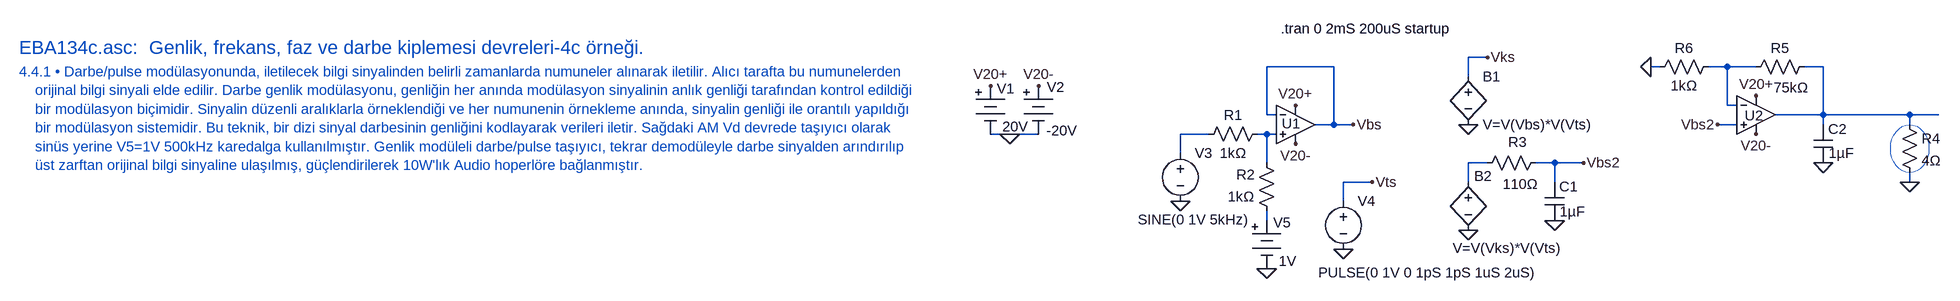
[diagram p0: schematic EBA134c.asc]
EBA134c.asc, the LTspice schematic file:
Version 4
SHEET 1 5332 4332
WIRE 2512 64 2480 64
WIRE 2256 80 2144 80
WIRE 2800 80 2784 80
WIRE 2912 80 2880 80
WIRE 2960 80 2912 80
WIRE 3072 80 3040 80
WIRE 2480 96 2480 64
WIRE 2912 144 2912 80
WIRE 2928 144 2912 144
WIRE 2144 160 2144 80
WIRE 2160 160 2144 160
WIRE 3072 160 3072 80
WIRE 3072 160 2992 160
WIRE 3216 160 3072 160
WIRE 3264 160 3216 160
WIRE 2256 176 2256 80
WIRE 2256 176 2224 176
WIRE 2288 176 2256 176
WIRE 2928 176 2896 176
WIRE 3072 176 3072 160
WIRE 3216 176 3216 160
WIRE 1664 192 1632 192
WIRE 1712 192 1664 192
WIRE 2048 192 2000 192
WIRE 2144 192 2128 192
WIRE 2160 192 2144 192
WIRE 2000 224 2000 192
WIRE 2144 240 2144 192
WIRE 2512 240 2480 240
WIRE 2624 240 2592 240
WIRE 2672 240 2624 240
WIRE 2320 272 2272 272
WIRE 2480 272 2480 240
WIRE 2624 272 2624 240
WIRE 3216 272 3216 256
WIRE 2272 304 2272 272
WIRE 2144 336 2144 320
FLAG 1664 192 0
FLAG 1632 112 V20+
FLAG 1712 112 V20-
FLAG 2192 144 V20+
FLAG 2192 208 V20-
FLAG 2000 304 0
FLAG 2144 416 0
FLAG 2272 384 0
FLAG 2480 176 0
FLAG 2288 176 Vbs
FLAG 2320 272 Vts
FLAG 2512 64 Vks
FLAG 2480 352 0
FLAG 2624 336 0
FLAG 2672 240 Vbs2
FLAG 3072 240 0
FLAG 3216 272 0
FLAG 2960 128 V20+
FLAG 2960 192 V20-
FLAG 2784 80 0
FLAG 2896 176 Vbs2
SYMBOL Misc\\battery 1632 96 R0
WINDOW 0 11 20 Left 2
WINDOW 3 20 84 Left 2
SYMATTR InstName V1
SYMATTR Value 20V
SYMBOL Misc\\battery 1712 96 R0
WINDOW 0 14 18 Left 2
WINDOW 3 13 90 Left 2
SYMATTR InstName V2
SYMATTR Value -20V
SYMBOL Opamps\\UniversalOpamp2 2192 176 R0
WINDOW 0 -23 -1 Left 2
SYMATTR InstName U1
SYMBOL res 2144 176 R90
WINDOW 0 0 56 VBottom 2
WINDOW 3 32 56 VTop 2
SYMATTR InstName R1
SYMATTR Value 1kΩ
SYMBOL res 2160 336 R180
WINDOW 0 36 76 Left 2
WINDOW 3 36 40 Left 2
SYMATTR InstName R2
SYMATTR Value 1kΩ
SYMBOL voltage 2000 208 R0
WINDOW 3 -71 127 Left 2
WINDOW 123 0 0 Left 0
WINDOW 39 0 0 Left 0
SYMATTR Value SINE(0 1V 5kHz)
SYMATTR InstName V3
SYMBOL voltage 2272 288 R0
WINDOW 3 -42 135 Left 2
WINDOW 123 0 0 Left 0
WINDOW 39 0 0 Left 0
SYMATTR Value PULSE(0 1V 0 1pS 1pS 1uS 2uS)
SYMATTR InstName V4
SYMBOL bv 2480 80 R0
SYMATTR InstName B1
SYMATTR Value V=V(Vbs)*V(Vts)
SYMBOL bv 2480 256 R0
WINDOW 0 10 6 Left 2
WINDOW 3 -26 126 Left 2
SYMATTR InstName B2
SYMATTR Value V=V(Vks)*V(Vts)
SYMBOL res 2608 224 R90
WINDOW 0 -3 46 VBottom 2
WINDOW 3 36 41 VTop 2
SYMATTR InstName R3
SYMATTR Value 110Ω
SYMBOL cap 2608 272 R0
WINDOW 3 25 49 Left 2
SYMATTR Value 1µF
SYMATTR InstName C1
SYMBOL cap 3056 176 R0
WINDOW 3 25 48 Left 2
SYMATTR Value 1µF
SYMATTR InstName C2
SYMBOL res 3200 160 R0
SYMATTR InstName R4
SYMATTR Value 4Ω
SYMBOL res 3056 64 R90
WINDOW 0 0 56 VBottom 2
WINDOW 3 35 38 VTop 2
SYMATTR InstName R5
SYMATTR Value 75kΩ
SYMBOL res 2896 64 R90
WINDOW 0 0 56 VBottom 2
WINDOW 3 32 56 VTop 2
SYMATTR InstName R6
SYMATTR Value 1kΩ
SYMBOL OpAmps\\UniversalOpAmp 2960 160 R0
WINDOW 0 -19 1 Left 2
SYMATTR InstName U2
SYMBOL Misc\\battery 2144 320 R0
WINDOW 0 11 20 Left 2
WINDOW 3 20 84 Left 2
SYMATTR InstName V5
SYMATTR Value 1V
TEXT -224 48 Left 3 ;EBA134c.asc:  Genlik, frekans, faz ve darbe kiplemesi devreleri-4c örneği.
TEXT -224 88 Left 2 ;4.4.1 • Darbe/pulse modülasyonunda, iletilecek bilgi sinyalinden belirli zamanlarda numuneler alınarak iletilir. Alıcı tarafta bu numunelerden \n    orijinal bilgi sinyali elde edilir. Darbe genlik modülasyonu, genliğin her anında modülasyon sinyalinin anlık genliği tarafından kontrol edildiği\n    bir modülasyon biçimidir. Sinyalin düzenli aralıklarla örneklendiği ve her numunenin örnekleme anında, sinyalin genliği ile orantılı yapıldığı\n    bir modülasyon sistemidir. Bu teknik, bir dizi sinyal darbesinin genliğini kodlayarak verileri iletir. Sağdaki AM Vd devrede taşıyıcı olarak\n    sinüs yerine V5=1V 500kHz karedalga kullanılmıştır. Genlik modüleli darbe/pulse taşıyıcı, tekrar demodüleyle darbe sinyalden arındırılıp\n    üst zarftan orijinal bilgi sinyaline ulaşılmış, güçlendirilerek 10W'lık Audio hoperlöre bağlanmıştır.
TEXT 2168 16 Left 2 !.tran 0 2mS 200uS startup
CIRCLE Normal 3248 256 3184 176 2

The netlist it stands for:
* EBA134c.asc
V1 V20+ 0 20V
V2 V20- 0 -20V
XU1 N004 Vbs V20+ V20- Vbs level.2 Avol=1Meg GBW=10Meg Slew=10Meg ilimit=25m rail=0 Vos=0 phimargin=45 en=0 enk=0 in=0 ink=0 Rin=500Meg  ; pins IN+ IN- V+ V- OUT
R1 N004 N003 1kΩ
R2 N006 N004 1kΩ
V3 N003 0 SINE(0 1V 5kHz)
V4 Vts 0 PULSE(0 1V 0 1pS 1pS 1uS 2uS)
B1 Vks 0 V=V(Vbs)*V(Vts)
B2 N005 0 V=V(Vks)*V(Vts)
R3 Vbs2 N005 110Ω
C1 Vbs2 0 1µF
C2 N002 0 1µF
R4 N002 0 4Ω
R5 N002 N001 75kΩ
R6 N001 0 1kΩ
XU2 Vbs2 N001 V20+ V20- N002 level1 Avol=1Meg GBW=10Meg Vos=0 En=0 Enk=0 In=0 Ink=0 Rin=500Meg  ; pins In+ In- V+ V- OUT
V5 N006 0 1V
* EBA134c.asc:  Genlik, frekans, faz ve darbe kiplemesi devreleri-4c örneği.
* 4.4.1 • Darbe/pulse modülasyonunda, iletilecek bilgi sinyalinden belirli zamanlarda numuneler alınarak iletilir. Alıcı tarafta bu numunelerden
*     orijinal bilgi sinyali elde edilir. Darbe genlik modülasyonu, genliğin her anında modülasyon sinyalinin anlık genliği tarafından kontrol edildiği
*     bir modülasyon biçimidir. Sinyalin düzenli aralıklarla örneklendiği ve her numunenin örnekleme anında, sinyalin genliği ile orantılı yapıldığı
*     bir modülasyon sistemidir. Bu teknik, bir dizi sinyal darbesinin genliğini kodlayarak verileri iletir. Sağdaki AM Vd devrede taşıyıcı olarak
*     sinüs yerine V5=1V 500kHz karedalga kullanılmıştır. Genlik modüleli darbe/pulse taşıyıcı, tekrar demodüleyle darbe sinyalden arındırılıp
*     üst zarftan orijinal bilgi sinyaline ulaşılmış, güçlendirilerek 10W'lık Audio hoperlöre bağlanmıştır.
.tran 0 2mS 200uS startup
.lib UniversalOpamps2.sub
.lib UniversalOpAmp1.lib
.backanno
.end